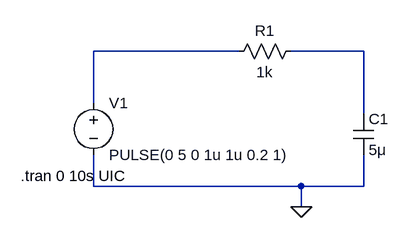
[diagram p0: schematic Draft3.asc]
Draft3.asc, the LTspice schematic file:
Version 4
SHEET 1 880 680
WIRE 400 160 176 160
WIRE 592 160 480 160
WIRE 176 240 176 160
WIRE 592 256 592 160
WIRE 176 368 176 320
WIRE 496 368 176 368
WIRE 592 368 592 320
WIRE 592 368 496 368
WIRE 496 400 496 368
FLAG 496 400 0
SYMBOL res 496 144 R90
WINDOW 0 0 56 VBottom 2
WINDOW 3 32 56 VTop 2
SYMATTR InstName R1
SYMATTR Value 1k
SYMBOL cap 576 256 R0
SYMATTR InstName C1
SYMATTR Value 5μ
SYMBOL voltage 176 224 R0
SYMATTR InstName V1
SYMATTR Value PULSE(0 5 0 1u 1u 0.2 1)
TEXT 64 352 Left 2 !.tran 0 10s UIC

The netlist it stands for:
* Draft3.asc
R1 N002 N001 1k
C1 N002 0 5μ
V1 N001 0 PULSE(0 5 0 1u 1u 0.2 1)
.tran 0 10s UIC
.backanno
.end